# EAGLE design hexad (EAGLE 7.7.0)

## Sheet 1 of 2: CPU
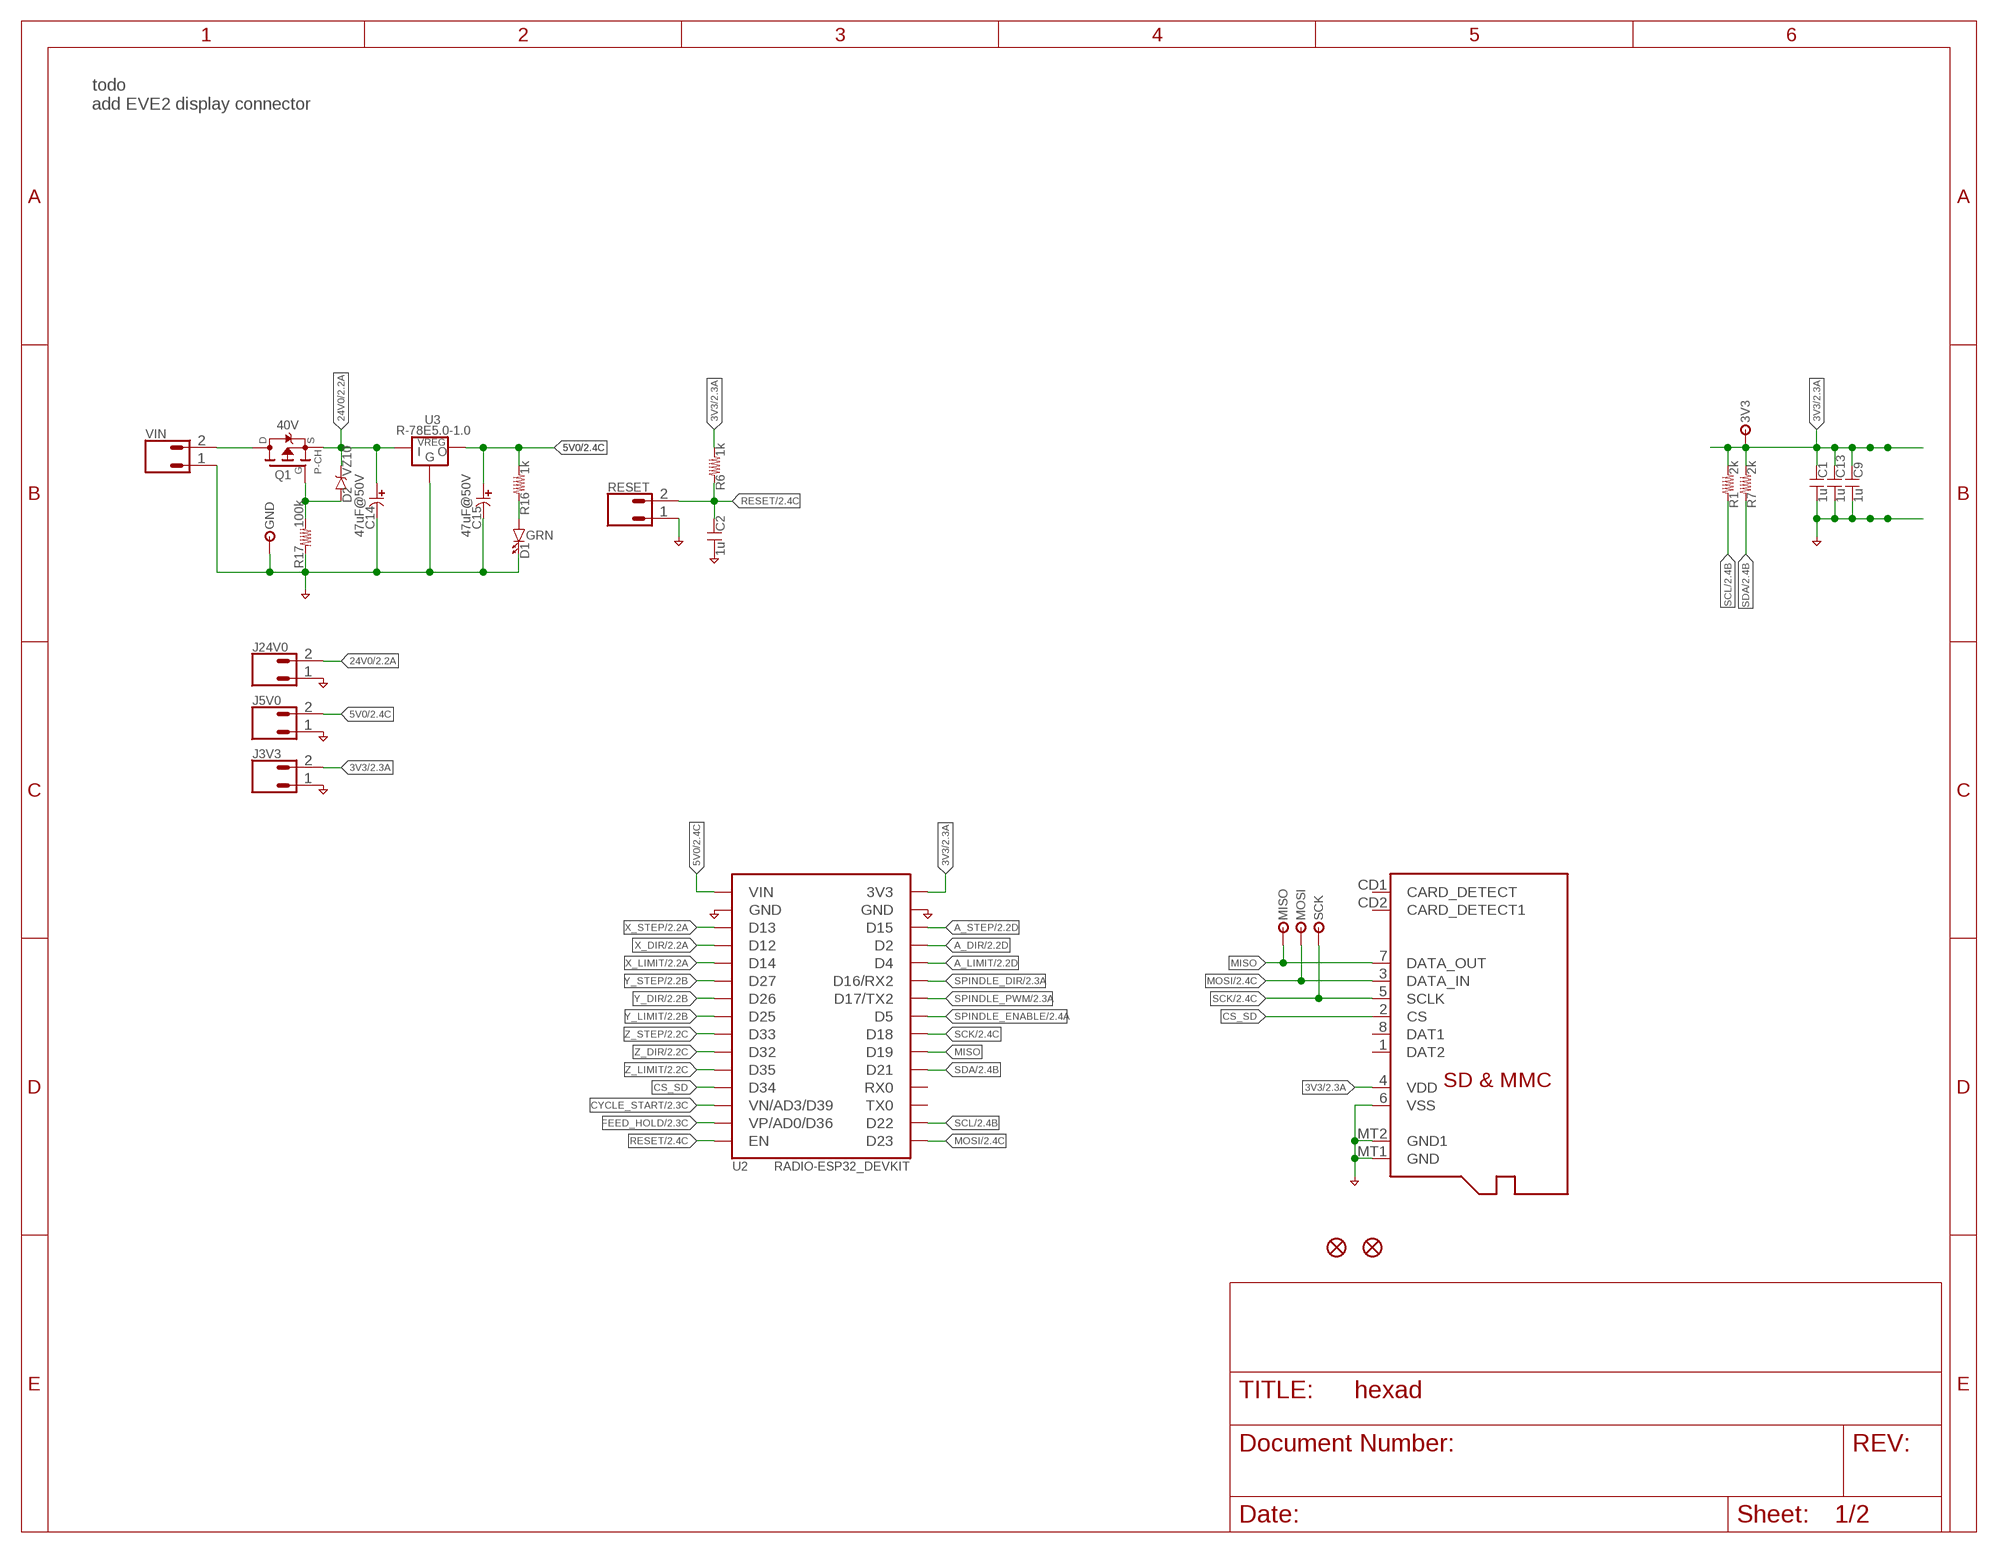
[diagram p0: schematic, sheet 1]

### Parts
3V3  TESTPOINTTHRU  [TPTHRU]
C1  1u  C-0603  [C-0603]
C2  1u  C-0603  [C-0603]
C9  1u  C-0603  [C-0603]
C13  1u  C-0603  [C-0603]
C14  47uF@50V  C-POLARIZED-E-6  [C-E-6]
C15  47uF@50V  C-POLARIZED-E-6  [C-E-6]
D1  GRN  LED-0603  [LED-0603]
D2  VZ10  DIODE-ZENER-SOD323  [D-SOD323]
FID1  FIDUCIAL-MICRO  [FIDUCIAL-MICRO]
FID2  FIDUCIAL-MICRO  [FIDUCIAL-MICRO]
GND  TESTPOINTTHRU  [TPTHRU]
J1  CONN-MICROSD-2908-05WB-MG  [CONN-MICROSD-2908-05WB-MG]
J3V3  CONN-02-.100-VERT-HEADER  [CONN-.100-2]
J5V0  CONN-02-.100-VERT-HEADER  [CONN-.100-2]
J24V0  CONN-02-.100-VERT-HEADER  [CONN-.100-2]
MISO  TESTPOINTTHRU  [TPTHRU]
MOSI  TESTPOINTTHRU  [TPTHRU]
Q1  40V  FET-PCH-TO252  [TO252]
R1  2k  R-0603  [R-0603]
R6  1k  R-0603  [R-0603]
R7  2k  R-0603  [R-0603]
R16  1k  R-0603  [R-0603]
R17  100k  R-0603  [R-0603]
RESET  CONN-02-.100-VERT-HEADER  [CONN-.100-2]
SCK  TESTPOINTTHRU  [TPTHRU]
U2  RADIO-ESP32_DEVKIT  [ESP32_DEVKIT]
U3  R-78E5.0-1.0  VREG-SIP3  [VREG-SIP3]
VIN  CONN-02-3.81MM-PLUGIN-SCREW  [CONN-3.81MM-KF2EDG-2]

### Nets
3V3: 3V3.1 C1.2 C9.2 C13.2 J1.4(VDD) J3V3.2 R1.2 R6.2 R7.2 U2.3V3 ; also sheet 2
5V0: C15.+ J5V0.2 R16.2 U2.VIN U3.3(VOUT) ; also sheet 2
24V0: C14.+ D2.C J24V0.2 Q1.2(S) U3.1(VIN) ; also sheet 2
A_DIR: U2.D2 ; also sheet 2
A_LIMIT: U2.D4 ; also sheet 2
A_STEP: U2.D15 ; also sheet 2
CS_SD: J1.2(CS) U2.D34
CYCLE_START: U2.VN(VN/AD3/D39) ; also sheet 2
FEED_HOLD: U2.VP(VP/AD0/D36) ; also sheet 2
GND: C1.1 C2.1 C9.1 C13.1 C14.- C15.- D1.C GND.1 J1.6(VSS) J1.MT1(GND) J1.MT2(GND1) J3V3.1 J5V0.1 J24V0.1 R17.1 RESET.1 U2.GND@1(GND) U2.GND@2(GND) U3.2(GND) VIN.1 ; also sheet 2
MISO: J1.7(DATA_OUT) MISO.1 U2.D19
MOSI: J1.3(DATA_IN) MOSI.1 U2.D23 ; also sheet 2
N$1: Q1.3(D) VIN.2
N$24: D2.A Q1.1(G) R17.2
N$84: D1.A R16.1
RESET: C2.2 R6.1 RESET.2 U2.EN ; also sheet 2
SCK: J1.5(SCLK) SCK.1 U2.D18 ; also sheet 2
SCL: R1.1 U2.D22 ; also sheet 2
SDA: R7.1 U2.D21 ; also sheet 2
SPINDLE_DIR: U2.RX2(D16/RX2) ; also sheet 2
SPINDLE_ENABLE: U2.D5 ; also sheet 2
SPINDLE_PWM: U2.TX2(D17/TX2) ; also sheet 2
X_DIR: U2.D12 ; also sheet 2
X_LIMIT: U2.D14 ; also sheet 2
X_STEP: U2.D13 ; also sheet 2
Y_DIR: U2.D26 ; also sheet 2
Y_LIMIT: U2.D25 ; also sheet 2
Y_STEP: U2.D27 ; also sheet 2
Z_DIR: U2.D32 ; also sheet 2
Z_LIMIT: U2.D35 ; also sheet 2
Z_STEP: U2.D33 ; also sheet 2
Unconnected: J1.1(DAT2) J1.8(DAT1) J1.CD1(CARD_DETECT) J1.CD2(CARD_DETECT1) U2.RX0 U2.TX0

### Notes on the sheet
- todo
  add EVE2 display connector

## Sheet 2 of 2: EXTERNAL
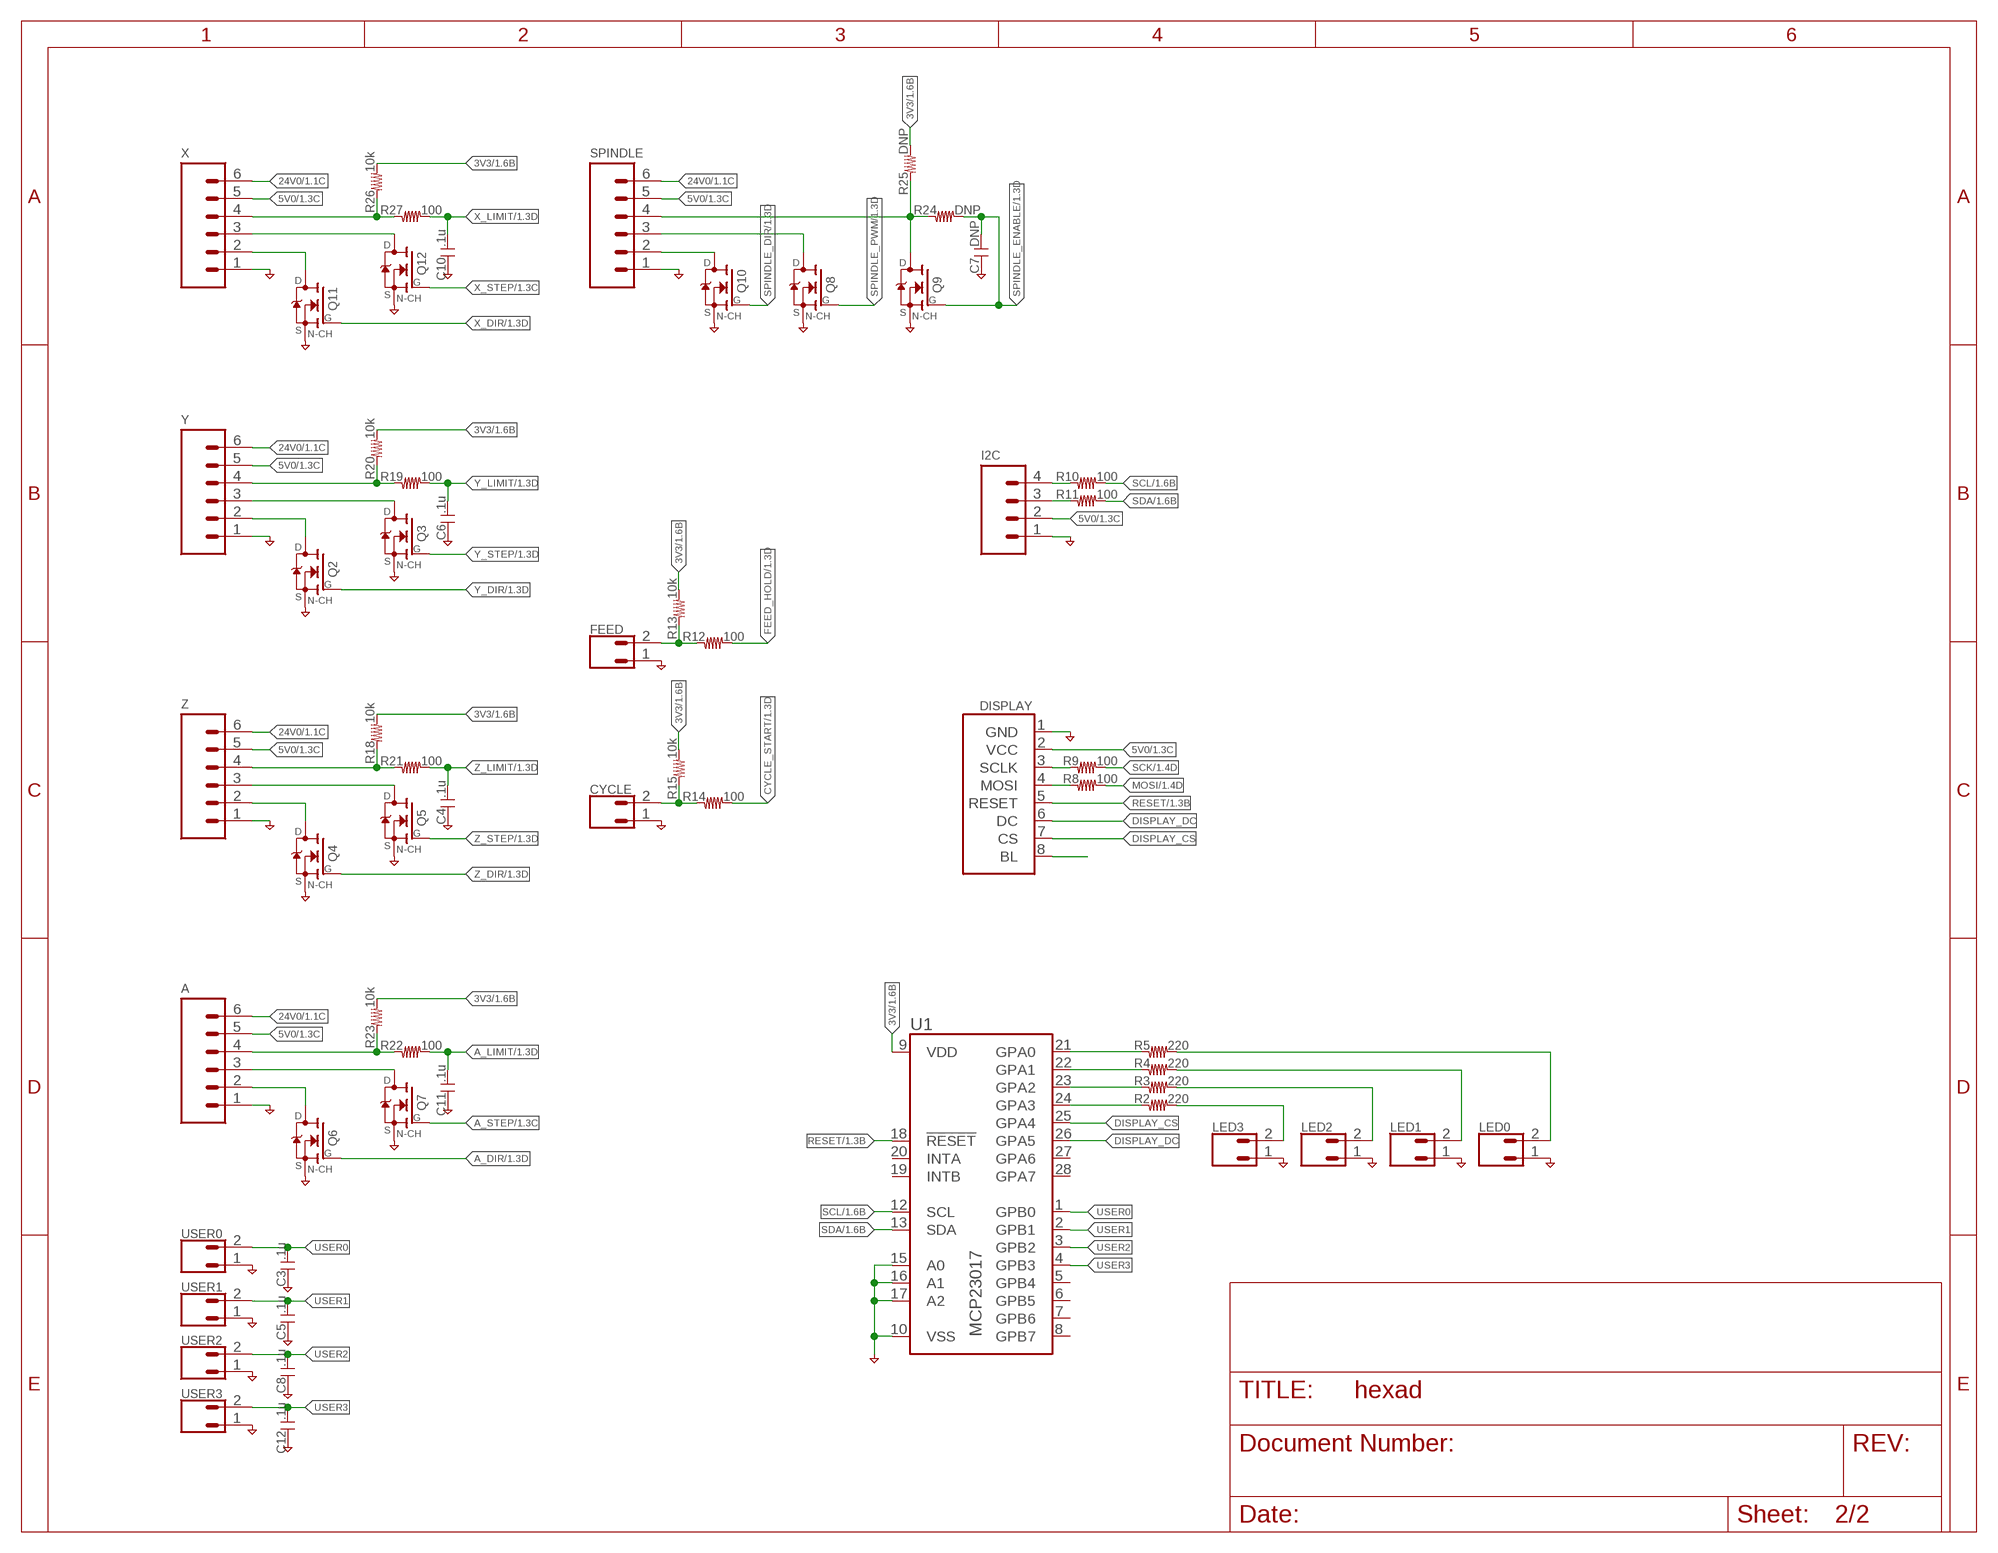
[diagram p1: schematic, sheet 2]

### Parts
A  CONN-06-.100-VERT-HEADER  [CONN-.100-6]
C3  .1u  C-0603  [C-0603]
C4  .1u  C-0603  [C-0603]
C5  .1u  C-0603  [C-0603]
C6  .1u  C-0603  [C-0603]
C7  DNP  C-0603  [C-0603]
C8  .1u  C-0603  [C-0603]
C10  .1u  C-0603  [C-0603]
C11  .1u  C-0603  [C-0603]
C12  .1u  C-0603  [C-0603]
CYCLE  CONN-02-.100-VERT-HEADER  [CONN-.100-2]
DISPLAY  DISP-SPI-TFT-128X160-ST7735  [1X08]
FEED  CONN-02-.100-VERT-HEADER  [CONN-.100-2]
I2C  CONN-04-.100-VERT-HEADER  [CONN-.100-4]
LED0  CONN-02-.100-VERT-HEADER  [CONN-.100-2]
LED1  CONN-02-.100-VERT-HEADER  [CONN-.100-2]
LED2  CONN-02-.100-VERT-HEADER  [CONN-.100-2]
LED3  CONN-02-.100-VERT-HEADER  [CONN-.100-2]
Q2  FET-NCH-SOT23  [SOT23-3]
Q3  FET-NCH-SOT23  [SOT23-3]
Q4  FET-NCH-SOT23  [SOT23-3]
Q5  FET-NCH-SOT23  [SOT23-3]
Q6  FET-NCH-SOT23  [SOT23-3]
Q7  FET-NCH-SOT23  [SOT23-3]
Q8  FET-NCH-SOT23  [SOT23-3]
Q9  FET-NCH-SOT23  [SOT23-3]
Q10  FET-NCH-SOT23  [SOT23-3]
Q11  FET-NCH-SOT23  [SOT23-3]
Q12  FET-NCH-SOT23  [SOT23-3]
R2  220  R-0603  [R-0603]
R3  220  R-0603  [R-0603]
R4  220  R-0603  [R-0603]
R5  220  R-0603  [R-0603]
R8  100  R-0603  [R-0603]
R9  100  R-0603  [R-0603]
R10  100  R-0603  [R-0603]
R11  100  R-0603  [R-0603]
R12  100  R-0603  [R-0603]
R13  10k  R-0603  [R-0603]
R14  100  R-0603  [R-0603]
R15  10k  R-0603  [R-0603]
R18  10k  R-0603  [R-0603]
R19  100  R-0603  [R-0603]
R20  10k  R-0603  [R-0603]
R21  100  R-0603  [R-0603]
R22  100  R-0603  [R-0603]
R23  10k  R-0603  [R-0603]
R24  DNP  R-0603  [R-0603]
R25  DNP  R-0603  [R-0603]
R26  10k  R-0603  [R-0603]
R27  100  R-0603  [R-0603]
SPINDLE  CONN-06-.100-VERT-HEADER  [CONN-.100-6]
U1  IO-MCP23017SO  [SO28W]
USER0  CONN-02-.100-VERT-HEADER  [CONN-.100-2]
USER1  CONN-02-.100-VERT-HEADER  [CONN-.100-2]
USER2  CONN-02-.100-VERT-HEADER  [CONN-.100-2]
USER3  CONN-02-.100-VERT-HEADER  [CONN-.100-2]
X  CONN-06-.100-VERT-HEADER  [CONN-.100-6]
Y  CONN-06-.100-VERT-HEADER  [CONN-.100-6]
Z  CONN-06-.100-VERT-HEADER  [CONN-.100-6]

### Nets
3V3: R13.2 R15.2 R18.2 R20.2 R23.2 R25.2 R26.2 U1.9(VDD) ; also sheet 1
5V0: A.5 DISPLAY.2(VCC) I2C.2 SPINDLE.5 X.5 Y.5 Z.5 ; also sheet 1
24V0: A.6 SPINDLE.6 X.6 Y.6 Z.6 ; also sheet 1
A_DIR: Q6.1(G) ; also sheet 1
A_LIMIT: C11.1 R22.2 ; also sheet 1
A_STEP: Q7.1(G) ; also sheet 1
CYCLE_START: R14.2 ; also sheet 1
DISPLAY_CS: DISPLAY.7(CS) U1.25(GPA4)
DISPLAY_DC: DISPLAY.6(DC) U1.26(GPA5)
FEED_HOLD: R12.2 ; also sheet 1
GND: A.1 C3.2 C4.2 C5.2 C6.2 C7.2 C8.2 C10.2 C11.2 C12.2 CYCLE.1 DISPLAY.1(GND) FEED.1 I2C.1 LED0.1 LED1.1 LED2.1 LED3.1 Q2.2(S) Q3.2(S) Q4.2(S) Q5.2(S) Q6.2(S) Q7.2(S) Q8.2(S) Q9.2(S) Q10.2(S) Q11.2(S) Q12.2(S) SPINDLE.1 U1.10(VSS) U1.15(A0) U1.16(A1) U1.17(A2) USER0.1 USER1.1 USER2.1 USER3.1 X.1 Y.1 Z.1 ; also sheet 1
MOSI: R8.2 ; also sheet 1
N$2: R26.1 R27.1 X.4
N$3: DISPLAY.3(SCLK) R9.1
N$4: DISPLAY.4(MOSI) R8.1
N$5: Q11.3(D) X.2
N$6: R19.1 R20.1 Y.4
N$7: Q2.3(D) Y.2
N$8: R18.1 R21.1 Z.4
N$9: Q4.3(D) Z.2
N$10: A.4 R22.1 R23.1
N$11: A.2 Q6.3(D)
N$12: R5.1 U1.21(GPA0)
N$13: Q9.3(D) R24.1 R25.1 SPINDLE.4
N$14: Q10.3(D) SPINDLE.2
N$15: R4.1 U1.22(GPA1)
N$16: FEED.2 R12.1 R13.1
N$17: CYCLE.2 R14.1 R15.1
N$18: I2C.4 R10.1
N$19: I2C.3 R11.1
N$20: DISPLAY.8(BL)
N$22: R3.1 U1.23(GPA2)
N$23: R2.1 U1.24(GPA3)
N$26: LED3.2 R2.2
N$27: LED2.2 R3.2
N$28: LED1.2 R4.2
N$29: LED0.2 R5.2
RESET: DISPLAY.5(RESET) U1.18(!RESET) ; also sheet 1
SCK: R9.2 ; also sheet 1
SCL: R10.2 U1.12(SCL) ; also sheet 1
SDA: R11.2 U1.13(SDA) ; also sheet 1
SPINDLE_DIR: Q10.1(G) ; also sheet 1
SPINDLE_ENABLE: C7.1 Q9.1(G) R24.2 ; also sheet 1
SPINDLE_PWM: Q8.1(G) ; also sheet 1
USER0: C3.1 U1.1(GPB0) USER0.2
USER1: C5.1 U1.2(GPB1) USER1.2
USER2: C8.1 U1.3(GPB2) USER2.2
USER3: C12.1 U1.4(GPB3) USER3.2
X_DIR: Q11.1(G) ; also sheet 1
X_LIMIT: C10.1 R27.2 ; also sheet 1
X_STEP: Q12.1(G) ; also sheet 1
X_STEP_5V0: Q12.3(D) X.3
X_STEP_5V1: Q3.3(D) Y.3
X_STEP_5V2: Q5.3(D) Z.3
X_STEP_5V3: A.3 Q7.3(D)
X_STEP_5V4: Q8.3(D) SPINDLE.3
Y_DIR: Q2.1(G) ; also sheet 1
Y_LIMIT: C6.1 R19.2 ; also sheet 1
Y_STEP: Q3.1(G) ; also sheet 1
Z_DIR: Q4.1(G) ; also sheet 1
Z_LIMIT: C4.1 R21.2 ; also sheet 1
Z_STEP: Q5.1(G) ; also sheet 1
Unconnected: U1.5(GPB4) U1.6(GPB5) U1.7(GPB6) U1.8(GPB7) U1.19(INTB) U1.20(INTA) U1.27(GPA6) U1.28(GPA7)

## Library data of the parts
3V3 GND MISO MOSI SCK = holla:TESTPOINT; DNP: 1
A SPINDLE X Y Z = holla:CONN-06
C1-C13 = holla:C
C14 C15 = holla:C-POLARIZED
CYCLE FEED J3V3 J5V0 J24V0 LED0 LED1-LED3 RESET USER0 USER1-USER3 VIN = holla:CONN-02: CONN HEADER 2POS
D1 = holla:LED
D2 = holla:DIODE-ZENER
DISPLAY = holla:DISP-SPI-TFT-128X160-ST7735: SPI TFT LCD 128x160 1.8" inch Full Color 128x160 SPI Full Color TFT LCD Display Module ST7735S 3.3V Replace OLED Power Supply for Arduino DIY KIT
FID1 FID2 = holla:FIDUCIAL: Fiducial Alignment Points Various fiducial points for machine vision alignment.; DNP: 1
I2C = holla:CONN-04
J1 = holla:CONN-MICROSD-2908-05WB-MG: Micro-SD / Transflash card holder with SPI pinout For the 3M # 2908-05WB-MG and/or 4UCON #19656 push-push type also Amphenol - 101-00660-68-6
Q1 = holla:FET-PCH
Q2-Q12 = holla:FET-NCH
R1-R27 = holla:R
U1 = holla:IO-MCP23017: 16-bit input/output port expander with interrupt output http://ww1.microchip.com/downloads/en/DeviceDoc/21952a.pdf Source: http://ww1.microchip.com/downloads/en/DeviceDoc/21952a.pdf; MF: MICROCHIP; MPN: MCP23017-E/SO; OC_FARNELL: 1332087; OC_NEWARK: 31K2958
U2 = holla:RADIO-ESP32_DEVKIT: ESP32 DEVKIT BOARD
U3 = holla:VREG: Various 3 pin voltage regulators in different packages Double check the right pinout for the right part

## Board
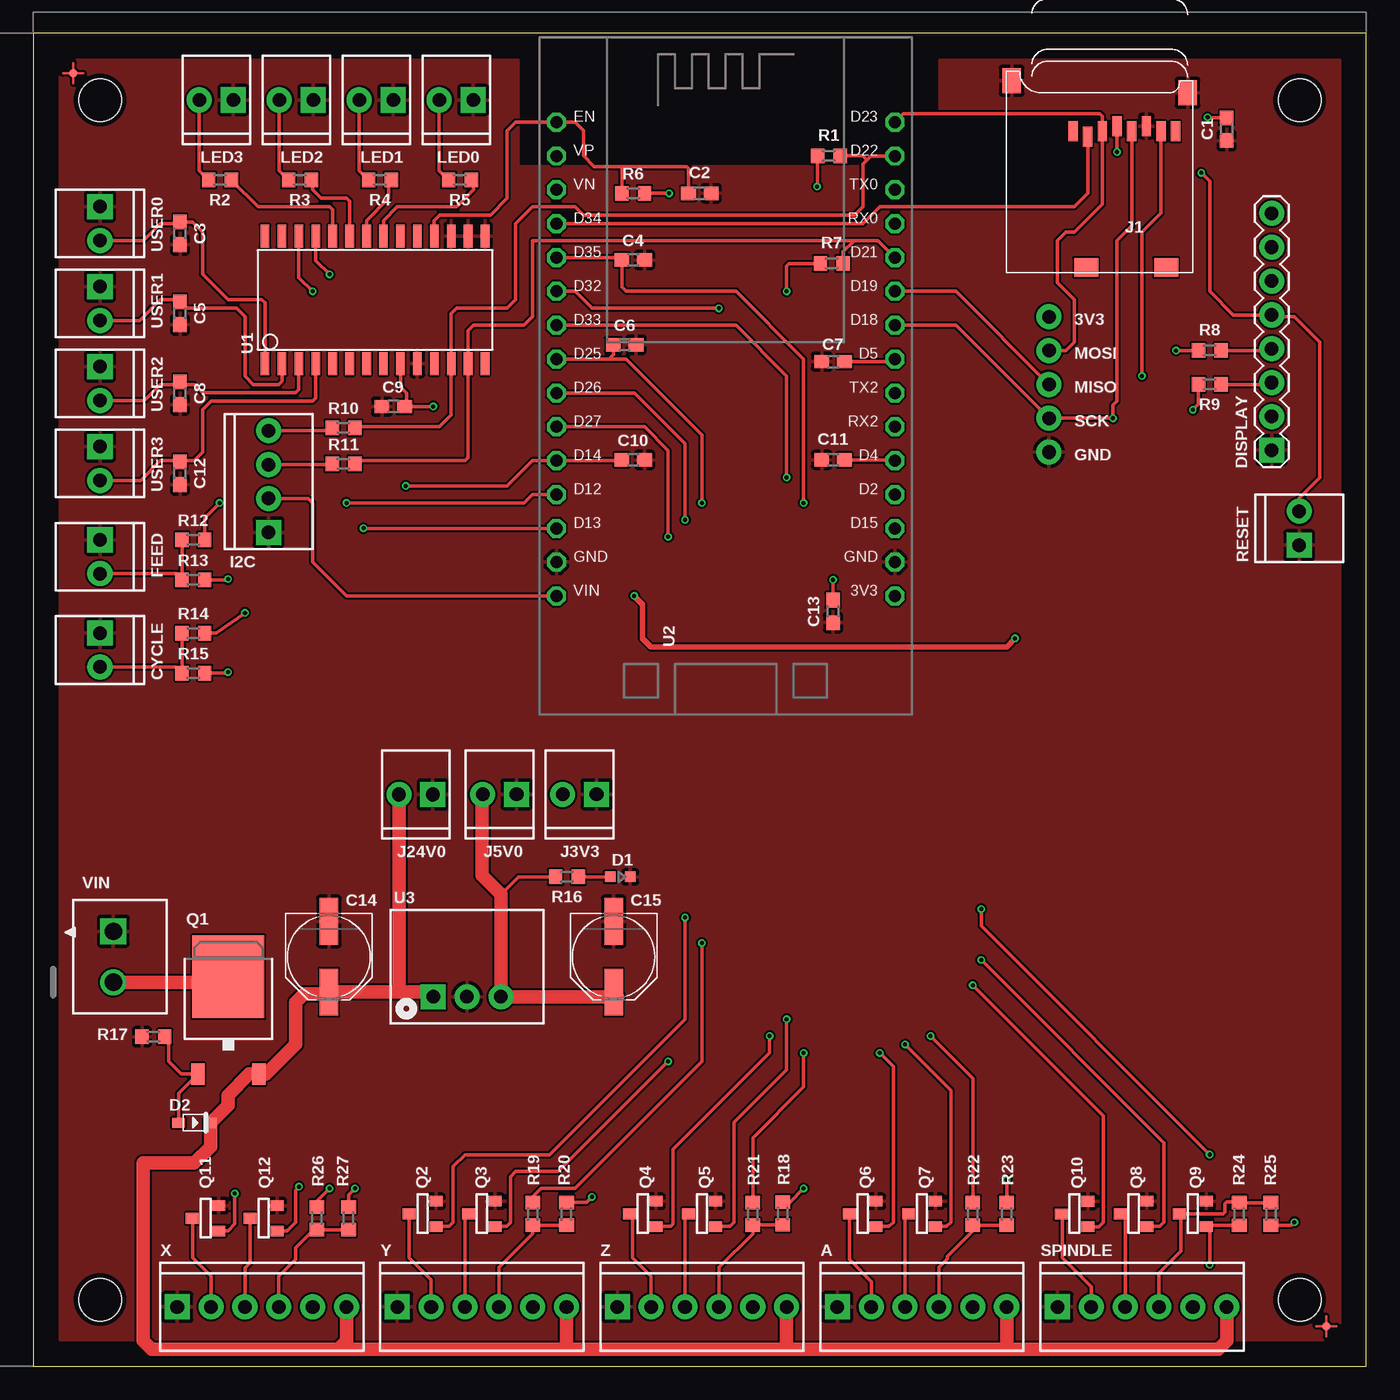
[diagram p2: board, top side]
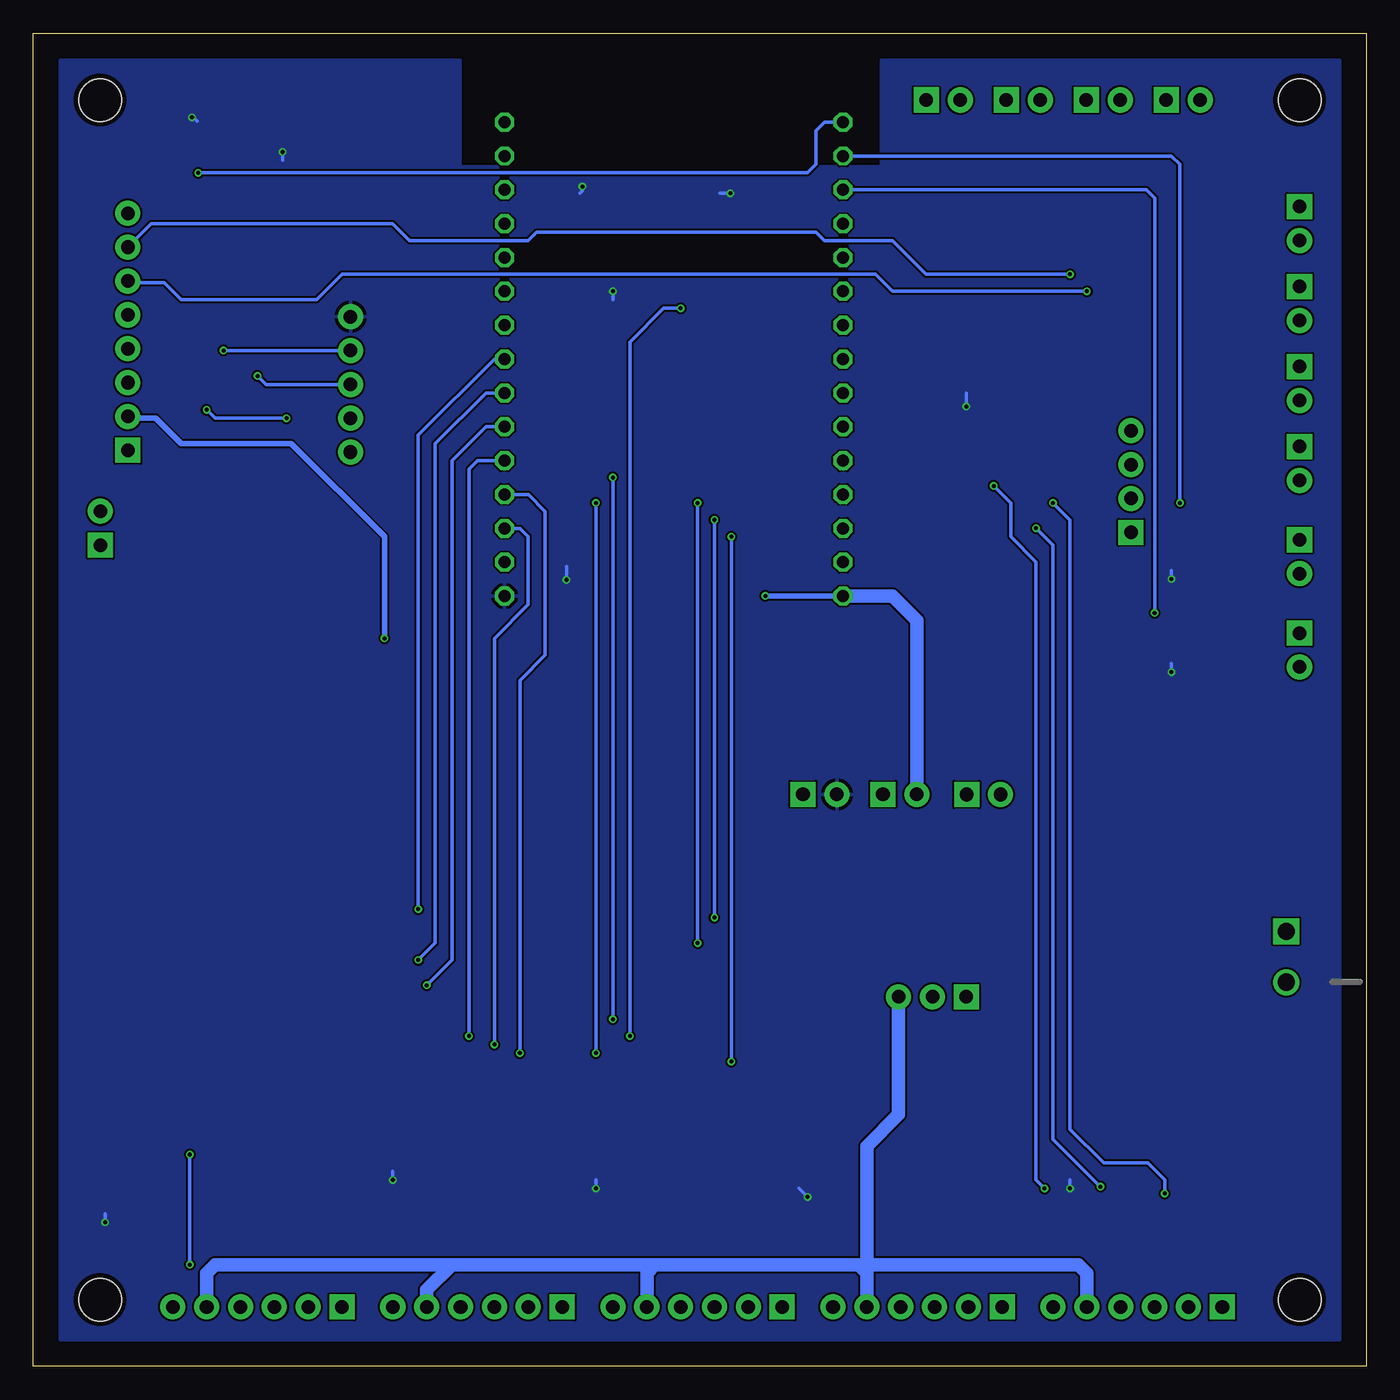
[diagram p3: board, bottom side, seen from below]

Size 100 x 100 mm. Coordinates in mm from the lower left corner, seen from the top.
Outline: 0,0 100,0 100,100 0,100 0,0
Copper layers (1*16): Top 0.035559375mm / dielectric 1.6mm / Bottom 0.035559375mm
Design rules "oshpark-2layer": minimum track width 6mil, minimum drill 10mil, track to track 6mil, track to pad 6mil, pad to pad 6mil, via to via 6mil, smd to smd 6mil, copper to edge 15mil, drill to drill 6mil, minimum pad ring 5mil, minimum via ring 5mil, stop-mask expansion 2.5mil, vias tented up to drill 0mil, thermal gap 10mil
Holes 3.2 mm at 5,5 95,5 95,95 5,95
tKeepout: area 1.8,1.8 to 8.2,8.2; area 91.8,1.8 to 98.2,8.2; area 91.8,91.8 to 98.2,98.2; area 1.8,91.8 to 8.2,98.2

### Footprints (pad centres in the part's own frame; a part is rotated, then mirrored left to right if it is on the bottom)
TPTHRU = drill 1.016 pad 1.88: 1 0,0
CONN-.100-6 = drill 1.016 pad 1.88 square: 1 0,0 | drill 1.016 pad 1.88: 2 2.54,0; 3 5.08,0; 4 7.62,0; 5 10.16,0; 6 12.7,0
C-0603 = smd 1.1 x 1: 1 -0.85,0; 2 0.85,0
C-E-6 = smd 3.5 x 1.4: + 2.65,0; - -2.65,0
CONN-.100-2 = drill 1.016 pad 1.88 square: 1 0,0 | drill 1.016 pad 1.88: 2 2.54,0
LED-0603 = smd 0.8 x 0.8: A 0,-0.75; C 0,0.75
D-SOD323 = smd 1 x 0.8: A -1.2,0; C 1.2,0
1X08 = drill 1.016 pad 1.88 square: 1 0,0 | drill 1.016 pad 1.88: 2 2.54,0; 3 5.08,0; 4 7.62,0; 5 10.16,0; 6 12.7,0; 7 15.24,0; 8 17.78,0
FIDUCIAL-MICRO = smd 0.635 x 0.635: 1 0,0
CONN-.100-4 = drill 1.016 pad 1.88 square: 1 0,0 | drill 1.016 pad 1.88: 2 2.54,0; 3 5.08,0; 4 7.62,0
CONN-MICROSD-2908-05WB-MG = smd 0.7 x 1.5: 1 9,-10.64; 2 7.9,-10.24; 3 6.8,-10.64; 4 5.7,-11.04; 5 4.6,-10.64; 6 3.5,-11.04; 7 2.4,-10.64; 8 1.3,-10.64 | smd 1.8 x 1.4: CD1 2,-0.44; CD2 8,-0.44 | smd 1.4 x 1.9: MT1 0.4,-13.54; MT2 13.6,-14.44
TO252 = smd 1 x 1.6: 1 -2.28,-4.8; 2 2.28,-4.8 | smd 5.4 x 6.2: 3 0,2.5
SOT23-3 = smd 0.8 x 0.972: 1 -0.95,-1; 2 0.95,-1; 3 0,1
R-0603 = smd 1 x 1.1: 1 -0.85,0; 2 0.85,0
SO28W = smd 0.65 x 1.7: 1 -7.62,-4.78; 2 -6.35,-4.78; 3 -5.08,-4.78; 4 -3.81,-4.78; 5 -2.54,-4.78; 6 -1.27,-4.78; 7 0,-4.78; 8 1.27,-4.78; 9 2.54,-4.78; 10 3.81,-4.78; 11 5.08,-4.78; 12 6.35,-4.78; 13 7.62,-4.78; 14 8.89,-4.78; 15 8.89,4.78; 16 7.62,4.78; 17 6.35,4.78; 18 5.08,4.78; 19 3.81,4.78; 20 2.54,4.78; 21 1.27,4.78; 22 0,4.78; 23 -1.27,4.78; 24 -2.54,4.78; 25 -3.81,4.78; 26 -5.08,4.78; 27 -6.35,4.78; 28 -7.62,4.78
ESP32_DEVKIT = drill 0.9 pad 1.422 octagon: 3V3 12.7,-17.78; D2 12.7,-10.16; D4 12.7,-7.62; D5 12.7,0; D12 -12.7,-10.16; D13 -12.7,-12.7; D14 -12.7,-7.62; D15 12.7,-12.7; D18 12.7,2.54; D19 12.7,5.08; D21 12.7,7.62; D22 12.7,15.24; D23 12.7,17.78; D25 -12.7,0; D26 -12.7,-2.54; D27 -12.7,-5.08; D32 -12.7,5.08; D33 -12.7,2.54; D34 -12.7,10.16; D35 -12.7,7.62; EN -12.7,17.78; GND@1 -12.7,-15.24; GND@2 12.7,-15.24; RX0 12.7,10.16; RX2 12.7,-5.08; TX0 12.7,12.7; TX2 12.7,-2.54; VIN -12.7,-17.78; VN -12.7,12.7; VP -12.7,15.24
VREG-SIP3 = drill 1.016 pad 1.88 square: 1 -2.54,0 | drill 1.016 pad 1.88: 2 0,0; 3 2.54,0
CONN-3.81MM-KF2EDG-2 = drill 1.3 square: 1 -1.905,0 | drill 1.3: 2 1.905,0

### Placement (x,y rotation side)
3V3  76.2,78.74 0 top
A  60.33,4.45 0 top
C1  89.53,92.81 90 top
C2  50,88 180 top
C3  11,85 270 top
C4  45,83 0 top
C5  11,79 270 top
C6  44.37,76.64 0 top
C7  60,75.36 180 top
C8  11,73 270 top
C9  27,72 0 top
C10  45,68 0 top
C11  60,68 180 top
C12  11,67 270 top
C13  60,56.63 90 top
C14  22.18,30.71 270 top
C15  43.54,30.71 270 top
CYCLE  5,55 270 top
D1  44.03,36.72 270 top
D2  12.1,18.27 0 top
DISPLAY  92.91,68.72 90 top
FEED  5,62 270 top
FID1  3,97 0 top
FID2  97,3 0 top
GND  76.2,68.58 0 top
I2C  17.64,62.56 90 top
J1  87,82 180 top
J3V3  42.26,42.91 180 top
J5V0  36.26,42.91 180 top
J24V0  29.97,42.9 180 top
LED0  33,95 180 top
LED1  27,95 180 top
LED2  21,95 180 top
LED3  15,95 180 top
MISO  76.2,73.66 0 top
MOSI  76.2,76.2 0 top
Q1  14.63,26.71 0 top
Q2  29.21,11.43 90 top
Q3  33.66,11.43 90 top
Q4  45.72,11.43 90 top
Q5  50.16,11.43 90 top
Q6  62.23,11.43 90 top
Q7  66.67,11.43 90 top
Q8  82.55,11.43 90 top
Q9  87,11.43 90 top
Q10  78.11,11.43 90 top
Q11  12.92,11.1 90 top
Q12  17.29,11.1 90 top
R1  59.69,90.81 180 top
R2  14,89 180 top
R3  20,89 180 top
R4  26,89 180 top
R5  32,89 180 top
R6  45,88 0 top
R7  59.91,82.73 180 top
R8  88.27,76.2 180 top
R9  88.27,73.66 180 top
R10  23.28,70.41 0 top
R11  23.28,67.69 0 top
R12  12,62 0 top
R13  12,59 0 top
R14  12,55 0 top
R15  12,52 0 top
R16  40.03,36.72 180 top
R17  9,24.71 0 top
R18  56.23,11.46 90 top
R19  37.47,11.43 90 top
R20  40.01,11.43 90 top
R21  53.98,11.43 90 top
R22  70.48,11.43 90 top
R23  73.03,11.43 90 top
R24  90.48,11.43 270 top
R25  92.84,11.43 270 top
R26  21.29,11.1 90 top
R27  23.65,11.1 90 top
RESET  94.97,61.6 90 top
SCK  76.2,71.12 0 top
SPINDLE  76.83,4.45 0 top
U1  25,80 0 top
U2  51.94,75.56 0 top
U3  32.54,27.71 0 top
USER0  5,87 270 top
USER1  5,81 270 top
USER2  5,75 270 top
USER3  5,69 270 top
VIN  6,30.71 270 top
X  10.79,4.45 0 top
Y  27.3,4.45 0 top
Z  43.81,4.45 0 top

### Tracks (layer width: path | path; a pad name or v marks a point on that pad's centre or on a via)
3V3  (via drill 0.3)
  Top 0.254: C13.2 v60,59 | J1.4 v81.3,91.1 | C1.2 88.14,93.66 v88.1,93.7 | R1.2 58.84,88.54 v58.8,88.5 | R6.2 v47.7,88 | U1.9 27.54,73.46 28,73 28,72.15 C9.2 v30,72 | R26.2 21.29,12.39 v22.23,13.34 | R20.2 41.49,12.28 v41.91,12.7 | R18.2 56.76,12.31 v57.78,13.34 | R23.2 v73.03,13.97 | R25.2 94.39,10.57 v94.61,10.79 | R15.2 14.54,52 v14.61,52.07 | R13.2 14.55,59 v14.61,59.05 | R7.2 56.7,82.73 56.52,82.55 v56.52,80.64
  Bottom 0.254: v60,59 60,60 | v81.3,91.1 81.3,90.5 | v88.1,93.7 88,93.7 87.7,93.4 | v58.8,88.5 58.8,88.2 59,88 | v47.7,88 48.5,88 | v30,72 30,73 | v22.23,13.34 22.23,13.97 | v41.91,12.7 42.55,13.34 | v57.78,13.34 57.78,13.97 | v73.03,13.97 73.03,14.61 | v94.61,10.79 94.61,11.43 | v14.61,52.07 14.61,52.7 | v14.61,59.05 14.61,59.69 | v56.52,80.64 56.52,80.01
  pour Bottom: 2,2 2,98 36.37,98 36.37,90 68,90 68,98 98,98 98,2
5V0  (via drill 0.3)
  Top 0.254: 39.52,36.38 R16.2 36.39,36.72 35.08,35.41 | U2.VIN 23.5,57.78 20.95,60.33 20.95,64.77 20.62,65.1 I2C.2
  Top 0.406: v73.66,54.61 73.03,53.98 46.35,53.98 45.72,54.61 45.72,57.15 v45.09,57.78
  Top 1.016: C15.+ 43.83,27.71 U3.3 35.08,35.41 33.66,36.83 33.66,42.84 J5V0.2
  Bottom 0.406: v73.66,54.61 73.66,62.23 80.64,69.22 88.9,69.22 90.81,71.12 92.78,71.12 DISPLAY.2 | U2.VIN v45.08,57.78 v45.09,57.78
  Bottom 1.016: U3.3 35.08,18.89 37.47,16.51 37.47,7.62 | Y.5 37.47,6.99 | 37.47,6.99 37.47,7.62 | X.5 20.95,6.99 21.59,7.62 37.47,7.62 | Z.5 53.98,6.99 53.34,7.62 | 53.34,7.62 52.7,7.62 38.1,7.62 37.47,6.99 | A.5 70.48,5.71 68.58,7.62 | 68.58,7.62 67.94,7.62 53.34,7.62 | SPINDLE.5 87,6.99 86.36,7.62 68.58,7.62 | J5V0.2 33.72,55.94 35.56,57.78 U2.VIN
24V0
  Top 1.016: 27.3,28.07 C14.+ 22.05,27.94 20.32,27.94 19.68,27.3 19.68,24.13 17.47,21.91 Q1.2 16.2,21.91 14.61,20.32 14.61,19.58 D2.C | 27.3,28.07 29.65,28.07 U3.1 | D2.C 13.29,17.74 | D2.C 13.29,16.47 12.06,15.24 8.26,15.24 8.26,1.91 8.89,1.27 22.86,1.27 | X.6 23.5,1.91 22.86,1.27 | SPINDLE.6 89.53,1.91 88.9,1.27 73.03,1.27 | 73.03,1.27 56.52,1.27 | 56.52,1.27 40.01,1.27 | 40.01,1.27 22.86,1.27 | Y.6 40.01,1.27 | Z.6 56.52,1.27 | A.6 73.03,1.27 | J24V0.2 27.43,28.19 27.3,28.07
A_DIR  (via drill 0.3)
  Top 0.254: Q6.1 64.2,10.48 64.52,10.79 64.52,22.48 v63.5,23.5
  Bottom 0.254: v63.5,23.5 63.5,51.44 61.59,53.34 61.59,64.14 62.86,65.4 U2.D2
A_LIMIT  (via drill 0.3)
  Top 0.254: C11.1 64.58,68 U2.D4 | R22.2 70.48,21.59 v67.31,24.77
  Bottom 0.254: U2.D4 66.68,67.94 67.31,67.31 v67.31,24.77
A_STEP  (via drill 0.3)
  Top 0.254: Q7.1 68.52,10.48 68.83,10.79 68.83,20.7 v65.41,24.13
  Bottom 0.254: v65.41,24.13 65.41,54.61 62.87,57.15 62.87,62.23 63.49,62.86 U2.D15
CS_SD
  Top 0.254: U2.D34 62.23,85.72 63.5,87 78.11,87 79.1,87.99 J1.2
CYCLE_START  (via drill 0.3)
  Top 0.254: R14.2 13.72,55 v15.88,56.52
  Bottom 0.254: U2.VN 16.5,88.26 15.88,87.63 v15.88,56.52
DISPLAY_CS  (via drill 0.3)
  Top 0.254: U1.25 21.19,82.95 v22.23,81.92
  Bottom 0.254: DISPLAY.7 91.14,85.72 73.03,85.72 71.75,84.45 62.87,84.45 62.23,85.09 41.27,85.09 40.64,84.45 35.56,84.45 33.02,81.92 v22.23,81.92
DISPLAY_DC  (via drill 0.3)
  Top 0.254: U1.26 19.92,81.68 v20.95,80.64
  Bottom 0.254: v20.95,80.64 35.56,80.64 36.83,81.92 76.83,81.92 78.74,80.01 88.9,80.01 90.17,81.28 92.78,81.28 DISPLAY.6
FEED_HOLD  (via drill 0.3)
  Top 0.254: R12.2 12.85,63.65 v13.97,64.77
  Bottom 0.254: U2.VP 14.61,90.8 13.97,90.17 v13.97,64.77
GND
  pour Top: 2,2 2,98 36.37,98 36.37,90 68,90 68,98 98,98 98,2
MISO  (via drill 0.3)
  Top 0.254: U2.D19 69.22,80.64 MISO.1 | J1.7 84.6,86.5 83.19,85.09 v83.19,74.3
  Bottom 0.254: v83.19,74.3 82.55,73.66 MISO.1
MOSI  (via drill 0.3)
  Top 0.254: U2.D23 65.28,93.98 80.01,93.98 80.2,93.79 J1.3 80.2,87.19 78.11,85.09 77.47,85.09 76.83,84.45 76.83,81.28 78.11,80.01 78.11,76.83 77.47,76.2 MOSI.1 | R8.2 v85.72,76.2
  Bottom 0.254: v85.72,76.2 MOSI.1
N$1
  Top 1.016: VIN.2 14.23,28.81 Q1.3
N$2
  Top 0.254: R27.1 R26.1 21.04,10.24 19.68,8.89 19.68,8.01 18.41,6.74 X.4
N$3
  Top 0.254: R9.1 92.78,73.66 DISPLAY.3
N$4
  Top 0.254: R8.1 92.78,76.2 DISPLAY.4
N$5
  Top 0.254: X.2 13.34,6.73 11.94,8.13 11.94,11.08 Q11.3
N$6
  Top 0.254: R20.1 R19.1 37.47,9.95 34.92,7.41 Y.4
N$7
  Top 0.254: Y.2 29.84,6.48 28.19,8.13 28.19,11.41 Q2.3
N$8
  Top 0.254: Z.4 51.44,7.41 53.98,9.95 R21.1 54.01,10.61 R18.1
N$9
  Top 0.254: Z.2 46.35,6.73 44.96,8.13 44.96,11.19 Q4.3
N$10
  Top 0.254: R23.1 R22.1 70.48,10.16 68.58,8.26 68.58,8.04 67.94,7.41 A.4
N$11
  Top 0.254: A.2 62.87,6.35 61.21,8 61.21,11.41 Q6.3
N$12
  Top 0.254: U1.21 26.27,85.96 27.3,87 31.75,87 33.02,88.27 33.02,88.83 R5.1
N$13
  Top 0.254: SPINDLE.4 84.45,6.99 86.11,8.64 86.11,11.32 Q9.3 89.28,11.43 89.41,11.56 89.41,12.19 89.53,12.32 90.44,12.32 R24.1 R25.1
N$14
  Top 0.254: SPINDLE.2 79.38,5.97 77.22,8.13 77.22,11.32 Q10.3
N$15
  Top 0.254: U1.22 25,85.96 26.67,87.63 26.67,88.82 R4.1
N$16
  Top 0.254: FEED.2 10.69,59.46 R13.1 R12.1
N$17
  Top 0.254: R14.1 R15.1 10.69,52.46 CYCLE.2
N$18
  Top 0.254: I2C.4 22.2,70.18 R10.1
N$19
  Top 0.254: I2C.3 22.38,67.64 R11.1
N$22
  Top 0.254: U1.23 23.73,87.39 23.5,87.63 21.59,87.63 20.95,88.27 20.95,88.89 R3.1
N$23
  Top 0.254: U1.24 22.46,86.76 22.23,87 16.86,87 R2.1
N$24
  Top 0.254: D2.A 10.89,20.45 Q1.1 11.11,21.91 10.16,22.86 10.16,24.41 R17.2
N$26
  Top 0.254: LED3.2 12.46,89.69 R2.2
N$27
  Top 0.254: LED2.2 18.46,89.69 R3.2
N$28
  Top 0.254: LED1.2 24.46,89.69 R4.2
N$29
  Top 0.254: LED0.2 30.46,89.69 R5.2
N$84
  Top 0.254: R16.1 D1.A
RESET  (via drill 0.3)
  Top 0.254: U1.18 30.08,85.96 30.48,86.36 34.29,86.36 35.56,87.63 35.56,92.71 36.2,93.34 U2.EN 40.64,93.34 41.27,92.7 41.27,90.81 42.08,90 44.15,90 | v87.63,89.53 88.27,88.9 88.27,80.64 90.03,78.88 DISPLAY.5 93.05,78.74 94.61,78.74 96.52,76.83 96.52,66.67 94.97,65.13 RESET.2 | R6.1 44.15,90 | C2.2 49.15,89.85 49,90 44.15,90
  Bottom 0.254: v87.63,89.53 41.91,89.53 41.27,90.17 41.27,92.7 40.64,93.34 U2.EN
SCK  (via drill 0.3)
  Top 0.254: U2.D18 69.22,78.1 SCK.1 v81.01,71.12 81.01,72.12 81.28,72.39 81.28,84.45 82.4,85.58 J1.5 | R9.2 87.42,72.17 v87,71.75
  Bottom 0.254: v87,71.75 86.36,71.12 v81.01,71.12
SCL
  Top 0.254: U2.D22 62.86,90.8 62.55,90.49 | 62.55,90.49 62.23,90.17 62.23,87 61.59,86.36 41.27,86.36 40.64,87 37.47,87 36.2,85.72 36.2,80.01 35.56,79.38 31.75,79.38 31.35,78.97 U1.12 31.35,71.36 30.48,70.48 24.2,70.48 R10.2 | R1.1 62.23,90.81 62.55,90.49
SDA
  Top 0.254: R11.2 24.38,67.94 32.38,67.94 32.62,68.18 U1.13 32.62,77.7 33.02,78.11 36.83,78.11 37.47,78.74 37.47,84.45 61.59,84.45 | 61.59,84.45 63.37,84.45 U2.D21 | R7.1 60.76,83.61 61.59,84.45
SPINDLE_DIR  (via drill 0.3)
  Top 0.254: Q10.1 79.94,10.47 80.26,10.79 80.26,18.8 v70.48,28.57
  Bottom 0.254: U2.RX2 66.05,70.48 68.58,67.94 68.58,30.48 v70.48,28.57
SPINDLE_ENABLE  (via drill 0.3)
  Top 0.254: v71.12,34.29 71.12,33.02 v88.27,15.88 | v88.27,7.62 88.27,10.21 Q9.1 88.09,10.57 R24.2 | C7.1 64.44,75.36 U2.D5
  Bottom 0.254: v71.12,34.29 71.12,69.85 65.41,75.56 U2.D5 | v88.27,15.88 v88.27,7.62
SPINDLE_PWM  (via drill 0.3)
  Top 0.254: v71.12,30.48 84.84,16.76 84.84,10.79 84.52,10.48 Q8.1
  Bottom 0.254: U2.TX2 66.05,73.02 69.85,69.22 69.85,31.75 v71.12,30.48
USER0
  Top 0.254: USER0.2 8.26,84.46 9.53,85.72 10.88,85.72 C3.1 11.94,85.85 12.7,85.09 12.7,81.92 14.61,80.01 17.14,80.01 17.38,79.78 U1.1
USER1
  Top 0.254: USER1.2 7.97,78.46 9.53,80.01 10.84,80.01 C5.1 11.47,79.38 15.24,79.38 15.88,78.74 15.88,74.3 16.51,73.66 18.41,73.66 18.65,73.89 U1.2
USER2
  Top 0.254: USER2.2 8.32,72.46 9.53,73.66 10.81,73.66 C8.1 11.19,73.66 12.06,73.66 12.7,73.03 19.68,73.03 19.92,73.26 U1.3
USER3
  Top 0.254: USER3.2 8.04,66.46 9.53,67.94 10.9,67.94 C12.1 11.1,67.94 12.06,67.94 12.7,68.58 12.7,71.75 13.34,72.39 20.95,72.39 21.19,72.62 U1.4
X_DIR  (via drill 0.3)
  Top 0.254: U2.D12 37.46,65.4 36.83,64.77 v23.5,64.77 | v15.11,12.95 15.11,10.67 14.61,10.16 13.94,10.16 Q11.1
  Bottom 0.254: v23.5,64.77 22.23,63.5 22.23,17.78 19.68,15.24 16.38,15.24 15.11,13.97 v15.11,12.95
X_LIMIT  (via drill 0.3)
  Top 0.254: C10.1 44.09,67.94 U2.D14 37.47,67.94 35.56,66.04 v27.94,66.04 | R27.2 23.65,12.86 v24.13,13.34
  Bottom 0.254: v24.13,13.34 24.77,13.97 24.77,60.33 26.67,62.23 26.67,64.77 v27.94,66.04
X_STEP  (via drill 0.3)
  Top 0.254: Q12.1 19.04,10.14 19.68,10.79 19.68,13.21 v19.94,13.46 | U2.D13 v24.77,62.86 v24.77,62.87
  Bottom 0.254: v24.77,62.87 23.5,61.59 23.5,17.02 v19.94,13.46
X_STEP_5V0
  Top 0.254: 16.38,11 Q12.3 16.26,11.07 16.26,7.75 15.88,7.37 X.3
X_STEP_5V1
  Top 0.254: Y.3 32.38,11.16 Q3.3
X_STEP_5V2
  Top 0.254: Z.3 48.9,11.16 Q5.3
X_STEP_5V3
  Top 0.254: A.3 65.41,11.16 Q7.3
X_STEP_5V4
  Top 0.254: SPINDLE.3 81.92,11.06 Q8.3
Y_DIR  (via drill 0.3)
  Top 0.254: U2.D26 45.09,73.02 48.9,69.22 v48.9,63.5 | v48.9,33.66 48.9,26.04 38.73,15.88 32.38,15.88 31.5,14.99 31.5,10.79 31.18,10.48 Q2.1
  Bottom 0.254: v48.9,63.5 v48.9,33.66
Y_LIMIT  (via drill 0.3)
  Top 0.254: U2.D25 43.18,75.56 | 43.18,75.56 44.45,75.56 50.16,69.85 v50.16,64.77 | v50.16,31.75 50.16,22.86 40.64,13.34 38.1,13.34 37.47,12.7 R19.2 | C6.1 43.52,75.89 43.18,75.56
  Bottom 0.254: v50.16,64.77 v50.16,31.75
Y_STEP  (via drill 0.3)
  Top 0.254: U2.D27 45.85,70.48 47.62,68.71 v47.62,62.23 | Q3.1 35.5,10.48 35.81,10.79 35.81,14.22 36.2,14.61 39.37,14.61 v47.62,22.86
  Bottom 0.254: v47.62,62.23 v47.62,22.86
Z_DIR  (via drill 0.3)
  Top 0.254: U2.D32 40.65,80.64 41.91,79.38 v51.44,79.38 | v55.24,24.77 55.24,23.5 48.01,16.26 48.01,10.67 47.82,10.48 Q4.1
  Bottom 0.254: v51.44,79.38 52.7,79.38 55.24,76.83 v55.24,24.77
Z_LIMIT  (via drill 0.3)
  Top 0.254: U2.D35 43.97,83.18 C4.1 44.15,80.94 44.45,80.64 52.7,80.64 57.78,75.56 v57.78,64.77 | v57.78,23.5 57.78,20.95 53.98,17.14 R21.2
  Bottom 0.254: v57.78,64.77 v57.78,23.5
Z_STEP  (via drill 0.3)
  Top 0.254: U2.D33 52.7,78.11 56.52,74.3 v56.52,66.67 | v56.52,26.04 56.52,22.23 52.58,18.29 52.58,10.79 52.26,10.48 Q5.1
  Bottom 0.254: v56.52,66.67 v56.52,26.04

### Text on the board
tDocu: hexad / 191101 / v1.0 | 5.0V